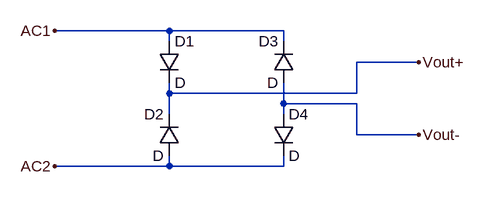
[diagram p0: schematic Puentediodo.asc]
Puentediodo.asc, the LTspice schematic file:
Version 4
SHEET 1 880 680
WIRE 112 48 -64 48
WIRE 288 48 112 48
WIRE 112 64 112 48
WIRE 288 64 288 48
WIRE 496 96 400 96
WIRE 112 144 112 128
WIRE 400 144 400 96
WIRE 400 144 112 144
WIRE 288 160 288 128
WIRE 400 160 288 160
WIRE 112 176 112 144
WIRE 288 176 288 160
WIRE 400 208 400 160
WIRE 496 208 400 208
WIRE 112 256 112 240
WIRE 112 256 -64 256
WIRE 288 256 288 240
WIRE 288 256 112 256
FLAG -64 48 AC1
FLAG -64 256 AC2
FLAG 496 96 Vout+
FLAG 496 208 Vout-
SYMBOL diode 96 64 R0
SYMATTR InstName D1
SYMBOL diode 128 240 R180
WINDOW 0 24 64 Left 2
WINDOW 3 24 0 Left 2
SYMATTR InstName D2
SYMBOL diode 304 128 R180
WINDOW 0 24 64 Left 2
WINDOW 3 24 0 Left 2
SYMATTR InstName D3
SYMBOL diode 272 176 R0
SYMATTR InstName D4

The netlist it stands for:
* Puentediodo.asc
D1 AC1 Vout+ D
D2 AC2 Vout+ D
D3 Vout- AC1 D
D4 Vout- AC2 D
.model D D
.lib standard.dio
.backanno
.end